# Altium schematic sheet SCH_IR.SchDoc
size A3; SheetNumber: 6; SheetTotal: 10
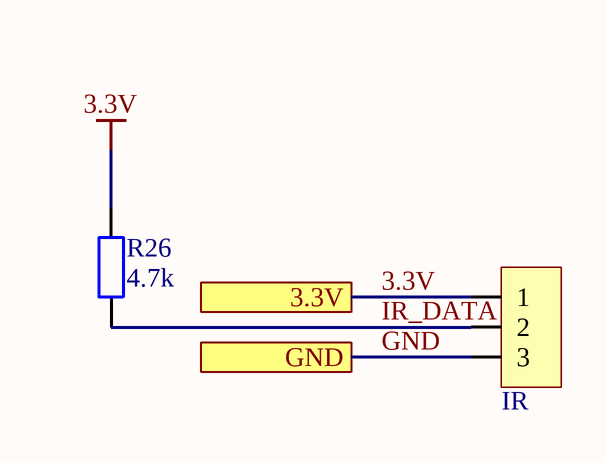
[diagram p0: SCH_IR.SchDoc]

## Parts
JP2  IR  [JP 1x3 CT]
R26  4.7k  [tro smd 0805]

## Ports
3.3V, GND

## Nets
3.3V: JP2.1 R26.2 ; port 3.3V
GND: JP2.3 ; port GND
IR_DATA: JP2.2 R26.1

## Library data of the parts
JP2 = JP 1x3 2.54 Cai Thang: Cắm; Ten_Linh_Kien: Jump Đơn Cái 2.54MM 1x20P Thẳng; Don_Vi: Con; Ma_Hang: MH004006; Ghi_Chu: *; Kieu_Chan: *; Chung_Loai: Cắm
R26 = Tro 0805 5% 4.7k: Dán; Don_Vi: Con; So_Chan: 2; Ten_Linh_Kien: Trở 0805 5% 4.7k; Ma_Hang: MH005307; Chung_Loai: Dán; Kieu_Chan: *